# Altium schematic sheet Motors.SchDoc
size A4; SheetNumber: 6; SheetTotal: 12
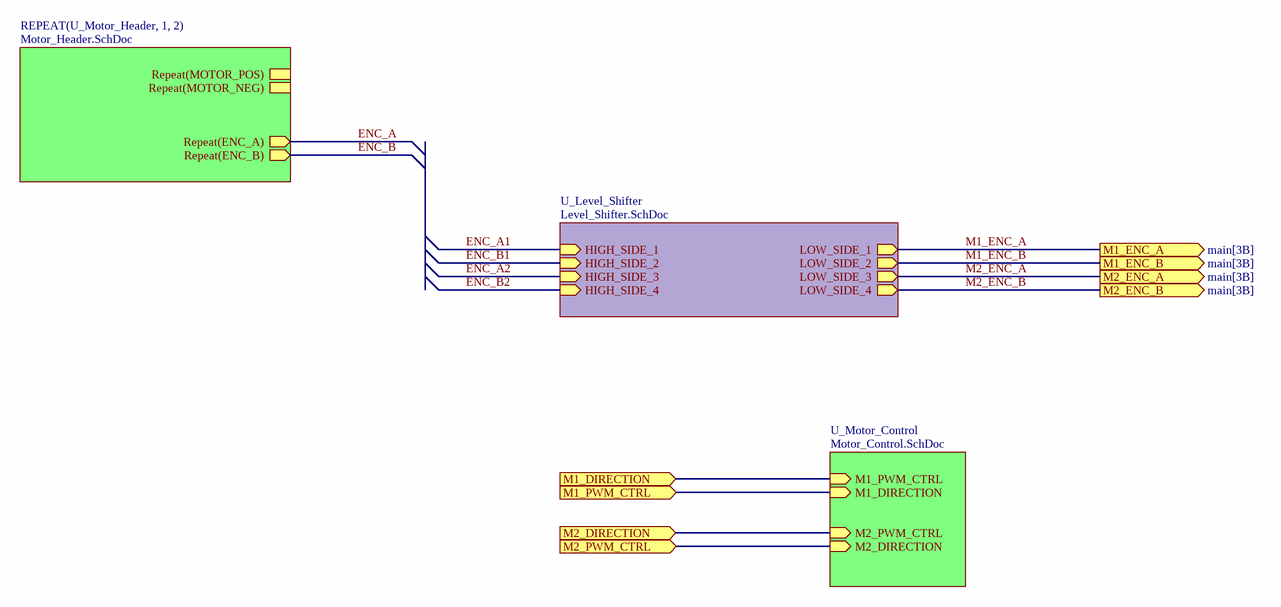
[diagram p0: Motors.SchDoc]

## Sub-sheets
REPEAT(U_Motor_Header, 1, 2) = Motor_Header.SchDoc: Repeat(MOTOR_POS), Repeat(MOTOR_NEG), Repeat(ENC_A) (out), Repeat(ENC_B) (out)
U_Level_Shifter = Level_Shifter.SchDoc: HIGH_SIDE_1 (in), HIGH_SIDE_2 (in), HIGH_SIDE_3 (in), HIGH_SIDE_4 (in), LOW_SIDE_1 (out), LOW_SIDE_2 (out), LOW_SIDE_3 (out), LOW_SIDE_4 (out)
U_Motor_Control = Motor_Control.SchDoc: M1_PWM_CTRL (in), M1_DIRECTION (in), M2_PWM_CTRL (in), M2_DIRECTION (in)

## Ports
M1_DIRECTION (in), M1_ENC_A (out, see main[3B]), M1_ENC_B (out, see main[3B]), M1_PWM_CTRL (in), M2_DIRECTION (in), M2_ENC_A (out, see main[3B]), M2_ENC_B (out, see main[3B]), M2_PWM_CTRL (in)

## Nets
ENC_A: sheet REPEAT(U_Motor_Header, 1, 2)/Repeat(ENC_A)
ENC_A1: sheet U_Level_Shifter/HIGH_SIDE_1
ENC_A2: sheet U_Level_Shifter/HIGH_SIDE_3
ENC_B: sheet REPEAT(U_Motor_Header, 1, 2)/Repeat(ENC_B)
ENC_B1: sheet U_Level_Shifter/HIGH_SIDE_2
ENC_B2: sheet U_Level_Shifter/HIGH_SIDE_4
M1_DIRECTION: port M1_DIRECTION, sheet U_Motor_Control/M1_PWM_CTRL
M1_ENC_A: port M1_ENC_A, sheet U_Level_Shifter/LOW_SIDE_1
M1_ENC_B: port M1_ENC_B, sheet U_Level_Shifter/LOW_SIDE_2
M1_PWM_CTRL: port M1_PWM_CTRL, sheet U_Motor_Control/M1_DIRECTION
M2_DIRECTION: port M2_DIRECTION, sheet U_Motor_Control/M2_PWM_CTRL
M2_ENC_A: port M2_ENC_A, sheet U_Level_Shifter/LOW_SIDE_3
M2_ENC_B: port M2_ENC_B, sheet U_Level_Shifter/LOW_SIDE_4
M2_PWM_CTRL: port M2_PWM_CTRL, sheet U_Motor_Control/M2_DIRECTION